# EasyEDA Pro project CDUT_PCB_Ver_0.0.1.epro

# Board PCB7
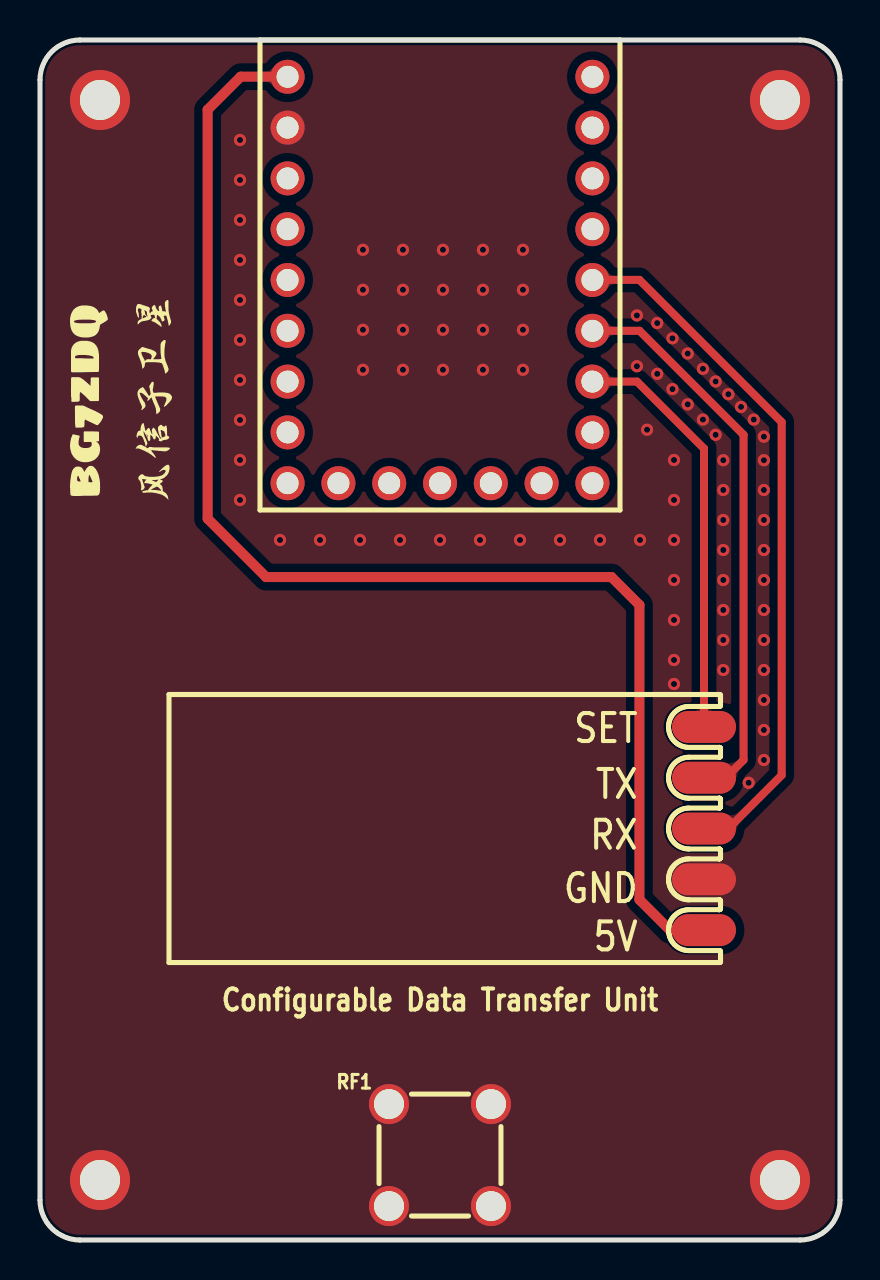
[diagram p0: board, top side]
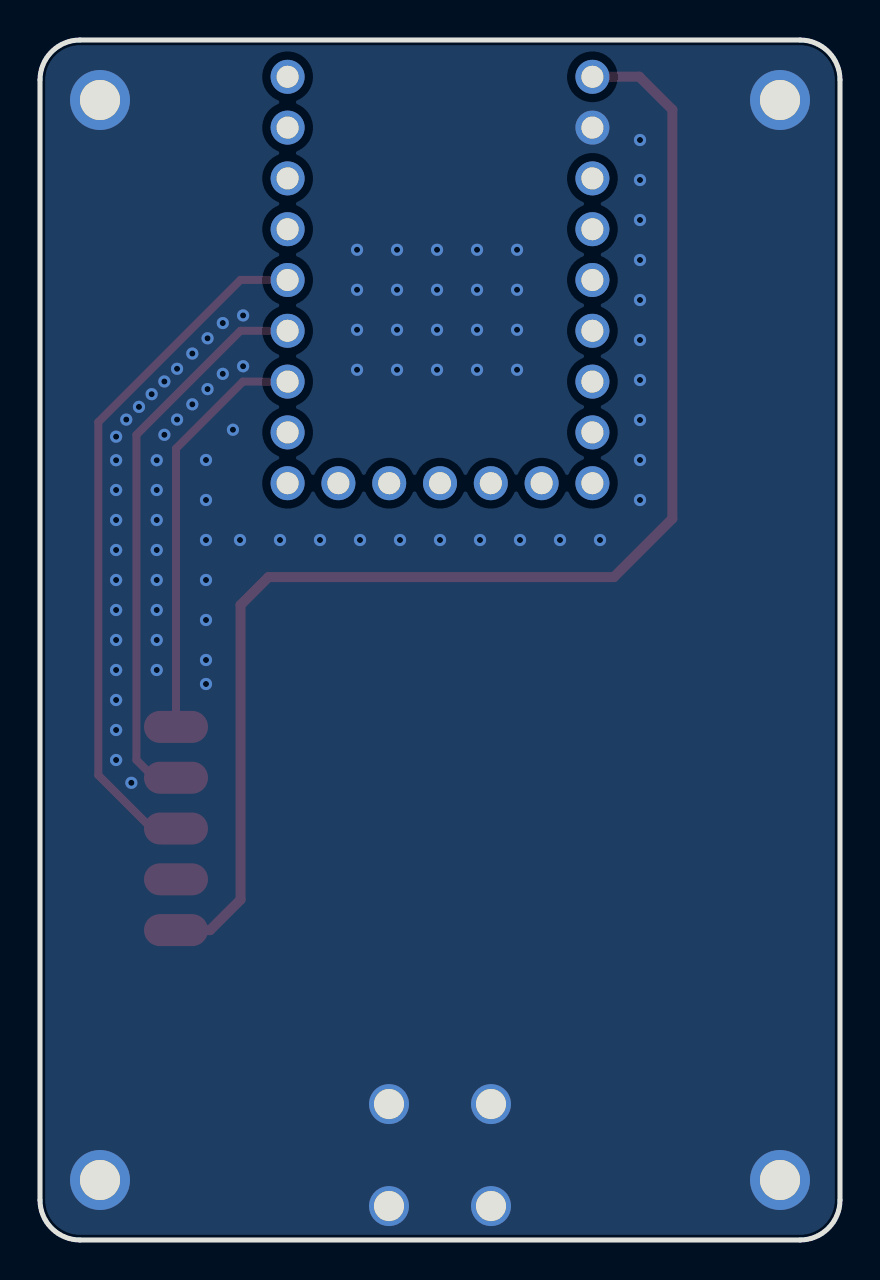
[diagram p1: board, bottom side, seen from below]

Outline 40 x 60 mm; copper layers: Top Layer, Bottom Layer. Coordinates in mm from the lower left corner of the outline.
Outline path: 0,58 0,2 arc(0.59,0.59) 2,0 38,0 arc(39.41,0.59) 40,2 40,58 arc(39.41,59.41) 38,60 2,60 arc(0.59,59.41) 0,58
Stack: Top Layer 0.035mm / Dielectric1 1.51mm FR4 er 4.5 / Bottom Layer 0.035mm

## Design rules (mm)
template: 自定义配置
spacing copperThickness1oz (default): track to track 0.102, other pairs 0.152 to 0.3
spacing copperThickness2oz: track to track 0.203, other pairs 0.152 to 0.3
track width copperThickness1oz (default): min 0.127, default 0.254, max 2.54
track width copperThickness2oz: min 0.203, default 0.254, max 2.54
differential pair differentialPair (default): width min 0.127, default 0.254, max 2.54; gap min 0.152, default 0.152
via viaSize (default): diameter min 0.5, default 0.61, max 10; hole min 0.3, default 0.305, max 6.3

## Placement (name value [footprint] x y rotation side)
NOREF  -  [Pad_e1]  3 57 0 top
NOREF#2  -  [Pad_e4]  37 3 0 top
NOREF#3  -  [Pad_e3]  3 3 0 top
NOREF#4  -  [Pad_e2]  37 57 0 top
RF1  6GHz  [SMA-TH_SMA-KWE-324-H13X15-LW]  20 4.25 0 top
U1  RP2040-Zero  [RP2040-ZERO-SOCKET]  20 48 0 top
U2  98a737dbef3b4dcda9651f0a71d40fd3  [HC-11/12_SMT]  20 20.57 180 top

## Footprints (pads in the part's own frame, mm; a bottom-side part is the same pattern mirrored in y, then rotated)
HC-11/12_SMT
  oval 3.2x1.6 smd: 1(-13.2,5.08) 2(-13.2,2.54) 3(-13.2,0) 4(-13.2,-2.54) 5(-13.2,-5.08)
Pad_e1
  round 3 hole 2: 1(0,0)
Pad_e2
  round 3 hole 2: 2(0,0)
Pad_e3
  round 3 hole 2: 3(0,0)
Pad_e4
  round 3 hole 2: 4(0,0)
RP2040-ZERO-SOCKET
  round 1.7 hole 1.1: 1(7.62,10.16) 2(7.62,7.62) 3(7.62,5.08) 4(7.62,2.54) 5(7.62,0) 6(7.62,-2.54) 7(7.62,-5.08) 8(7.62,-7.62) 9(7.62,-10.16) 10(5.08,-10.16) 11(2.54,-10.16) 12(0,-10.16) 13(-2.54,-10.16) 14(-5.08,-10.16) 15(-7.62,-10.16) 16(-7.62,-7.62) 17(-7.62,-5.08) 18(-7.62,-2.54) 19(-7.62,0) 20(-7.62,2.54) 21(-7.62,5.08) 22(-7.62,7.62) 23(-7.62,10.16)
SMA-TH_SMA-KWE-324-H13X15-LW
  round 2 hole 1.5: 1(-2.55,2.55) 2(2.55,2.55) 3(2.55,-2.55) 4(-2.55,-2.55)

## Nets
5V: U1.23 U2.1
GND: NOREF.1 NOREF#2.4 NOREF#3.3 NOREF#4.2 RF1.1 RF1.2 RF1.3 RF1.4 U1.22 U2.2
HC12-RX: U1.5 U2.3
HC12-SET: U1.7 U2.5
HC12-TX: U1.6 U2.4

Pads without a net: U1 1 2 3 4 8 9 10 11 12 13 14 15 16 17 18 19 20 21

## Via types
v1: diameter 0.61, hole 0.305, Top Layer to Bottom Layer, 84 vias

## Routing (per net, layer and track width the routed paths; a pad name or vN(x,y) marks a point on that pad's centre or on a via; arc(x,y) is an arc through that point)
5V: length 67.1
  Top Layer w0.5: U1.23 12.37,58.17 10.03,58.17 8.38,56.52 8.38,36.07 11.3,33.15 28.57,33.15 29.97,31.75 29.97,17.02 31.5,15.49 U2.1
GND:
  vias: v1(10,55) v1(10,53) v1(10,51) v1(10,49) v1(10,47) v1(10,45) v1(10,43) v1(10,41) v1(10,39) v1(10,37) v1(12,35) v1(14,35) v1(16,35) v1(16.15,49.51) v1(16.15,47.51) v1(16.15,45.51) v1(16.15,43.51) v1(18,35) v1(18.15,49.51) v1(18.15,47.51) v1(18.15,45.51) v1(18.15,43.51) v1(20,35) v1(20.15,49.51) v1(20.15,47.51) v1(20.15,45.51) v1(20.15,43.51) v1(22,35) v1(22.15,49.51) v1(22.15,47.51) v1(22.15,45.51) v1(22.15,43.51) v1(24,35) v1(24.15,49.51) v1(24.15,47.51) v1(24.15,45.51) v1(24.15,43.51) v1(26,35) v1(28,35) v1(29.84,46.23) v1(29.84,43.69) v1(30,35) v1(30.35,40.51) v1(30.86,45.85) v1(30.86,43.31) v1(31.62,45.08) v1(31.62,42.55) v1(31.7,39) v1(31.7,37) v1(31.7,35) v1(31.7,33) v1(31.7,31) v1(31.7,29) v1(31.7,27.8) v1(32.38,44.32) v1(32.38,41.78) v1(33.15,43.56) v1(33.15,41.02) v1(33.78,42.93) v1(33.78,40.26) v1(34.16,38.99) v1(34.16,37.5) v1(34.16,36) v1(34.16,34.5) v1(34.16,33) v1(34.16,31.5) v1(34.16,30) v1(34.16,28.5) v1(34.42,42.29) v1(35.05,41.66) v1(35.43,22.86) v1(35.69,41.02) v1(36.19,40.17) v1(36.19,38.99) v1(36.19,37.5) v1(36.19,36) v1(36.19,34.5) v1(36.19,33) v1(36.19,31.5) v1(36.19,30) v1(36.19,28.5) v1(36.19,27) v1(36.19,25.5) v1(36.19,24)
HC12-RX: length 35
  Top Layer w0.4: 27.63,48.01 29.97,48.01 37.08,40.89 37.08,23.24 34.42,20.57 U2.3
HC12-SET: length 20.9
  Top Layer w0.4: U2.5 33.2,39.57 29.85,42.92 U1.7
HC12-TX: length 28.3
  Top Layer w0.4: U2.4 34.29,23.11 35.18,24 35.18,40.26 29.98,45.46 U1.6

## Copper pours and planes (outline as drawn; the poured copper is in the pictures)
GND on Top Layer: 0,58 0.02,58.28 0.08,58.56 0.18,58.83 0.32,59.08 0.49,59.31 0.69,59.51 0.92,59.68 1.17,59.82 1.44,59.92 1.72,59.98 2,60 38,60 38.28,59.98 38.56,59.92 38.83,59.82 39.08,59.68 39.31,59.51 39.51,59.31 39.68,59.08 39.82,58.83 39.92,58.56 39.98,58.28 40,58 40,2 39.98,1.72 39.92,1.44 39.82,1.17 39.68,0.92 39.51,0.69 39.31,0.49 39.08,0.32 38.83,0.18 38.56,0.08 38.28,0.02 38,0 2,0 1.72,0.02 1.44,0.08 1.17,0.18 0.92,0.32 0.69,0.49 0.49,0.69 0.32,0.92 0.18,1.17 0.08,1.44 0.02,1.72 0,2
GND on Bottom Layer: 0,58 0.02,58.28 0.08,58.56 0.18,58.83 0.32,59.08 0.49,59.31 0.69,59.51 0.92,59.68 1.17,59.82 1.44,59.92 1.72,59.98 2,60 38,60 38.28,59.98 38.56,59.92 38.83,59.82 39.08,59.68 39.31,59.51 39.51,59.31 39.68,59.08 39.82,58.83 39.92,58.56 39.98,58.28 40,58 40,2 39.98,1.72 39.92,1.44 39.82,1.17 39.68,0.92 39.51,0.69 39.31,0.49 39.08,0.32 38.83,0.18 38.56,0.08 38.28,0.02 38,0 2,0 1.72,0.02 1.44,0.08 1.17,0.18 0.92,0.32 0.69,0.49 0.49,0.69 0.32,0.92 0.18,1.17 0.08,1.44 0.02,1.72 0,2

Small or netless copper shapes (teardrops, artwork), in the pictures only: 8 on Top Layer

## Text on the board
Top Silkscreen Layer: Configurable Data Transfer Unit | SET | TX | RX | GND | 5V
